# Altium schematic sheet LedMatrix_NanoBoardSingleDigit.SchDoc
size A4; Organization: Altium Limited; Address1: L3, 12a Rodborough Rd; Address2: Frenchs Forest; Address3: NSW; Address4: Australia 2086
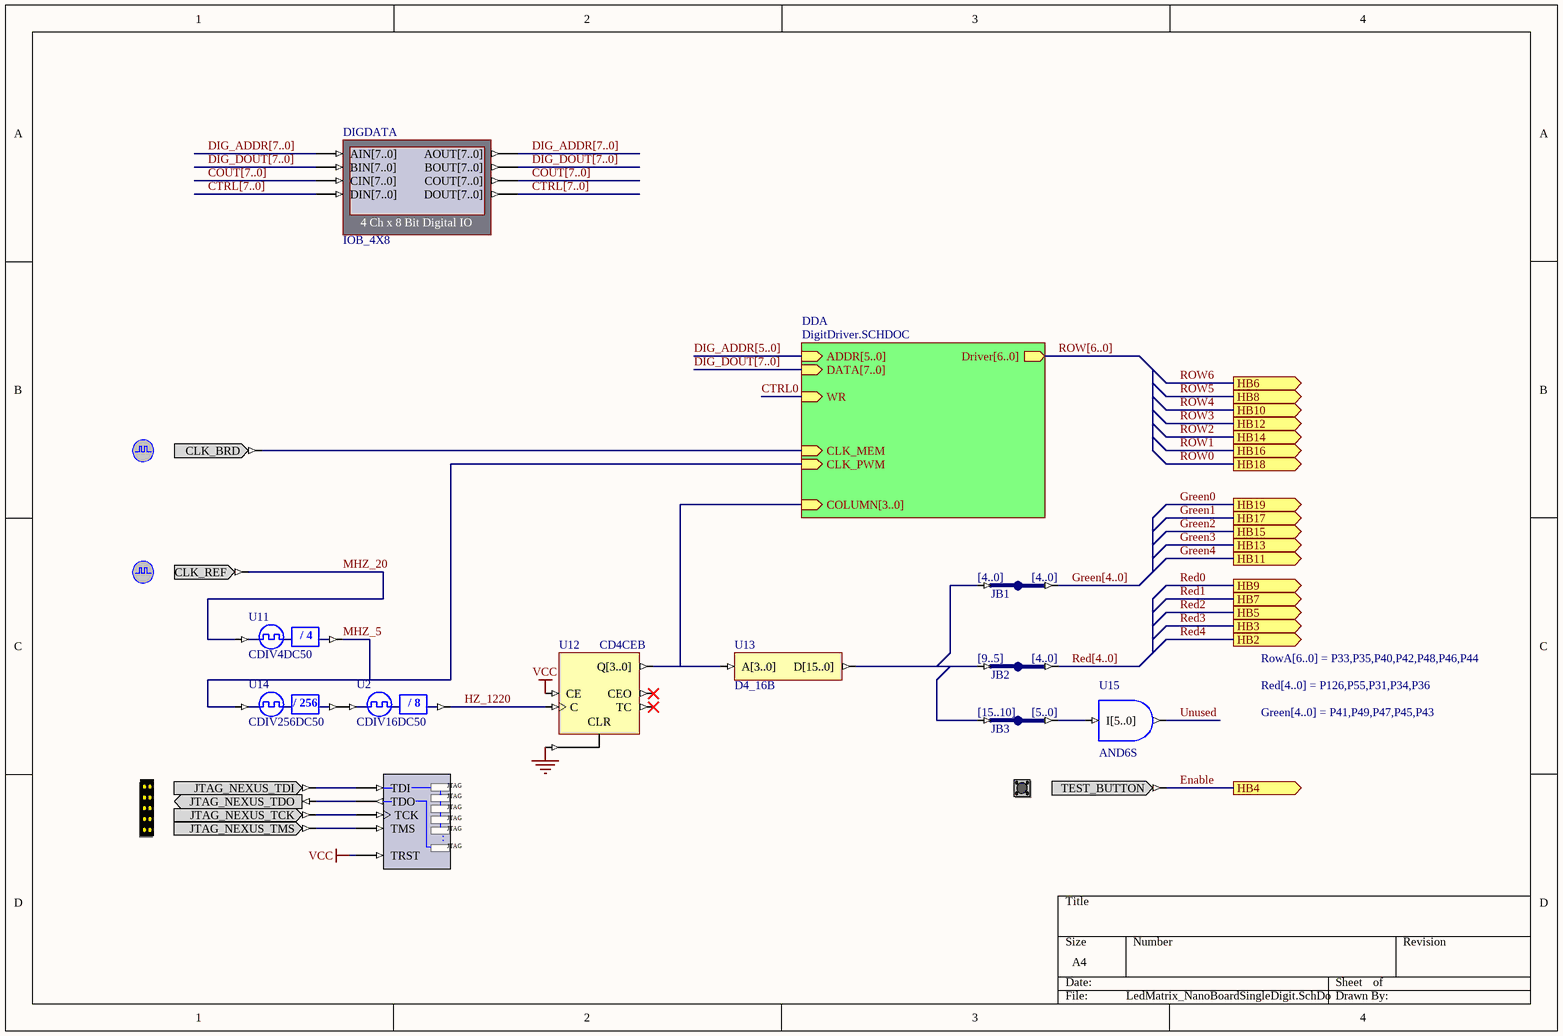
[diagram p0: LedMatrix_NanoBoardSingleDigit.SchDoc]

## Parts
(Parts that share a designator on the sheet are numbered #1, #2 ... from top to bottom, then left to right.)
?#1  CLOCK_BOARD  (value not drawn)
?#2  CLOCK_REFERENCE  (value not drawn)
?#3  NEXUS_JTAG_CONNECTOR  (value not drawn)
?#4  TEST_BUTTON  (value not drawn)
DIGDATA  IOB_4X8
JB1  IndexA: [4..0]  (hidden comment: JB)
JB2  IndexA: [9..5]  IndexB: [4..0]  (hidden comment: JB)
JB3  IndexA: [15..10]  IndexB: [5..0]  (hidden comment: JB)
NEXUS_JTAG_PORT  NEXUS_JTAG_PORT  (value not drawn)
U2  CDIV16DC50
U11  CDIV4DC50
U12  CD4CEB
U13  D4_16B
U14  CDIV256DC50
U15  AND6S

## Sub-sheets
DDA = DigitDriver.SCHDOC: COLUMN[3..0] (in), ADDR[5..0] (in), WR (in), DATA[7..0] (in), CLK_PWM (in), Driver[6..0] (out), CLK_MEM (in)

## Ports
HB2 (out), HB3 (out), HB4 (out), HB5 (out), HB6 (out), HB7 (out), HB8 (out), HB9 (out), HB10 (out), HB11 (out), HB12 (out), HB13 (out), HB14 (out), HB15 (out), HB16 (out), HB17 (out), HB18 (out), HB19 (out)

## Nets
GND: U12.CLR
VCC: NEXUS_JTAG_PORT.TRST U12.CE
COUT[7..0]: DIGDATA.CIN[7..0] DIGDATA.COUT[7..0]
CTRL0: sheet DDA/WR
CTRL[7..0]: DIGDATA.DIN[7..0] DIGDATA.DOUT[7..0]
DIG_ADDR[7..0]: DIGDATA.AIN[7..0] DIGDATA.AOUT[7..0]
DIG_DOUT[7..0]: DIGDATA.BIN[7..0] DIGDATA.BOUT[7..0] ; sheet DDA/DATA[7..0]
Enable: ?#4.TEST_BUTTON ; port HB4
Green0: port HB19
Green1: port HB17
Green2: port HB15
Green3: port HB13
Green4: port HB11
Green[4..0]: JB1.B[0..0]
HZ_1220: U2.CLKDV U12.C
MHZ_5: U11.CLKDV U14.CLKIN ; sheet DDA/CLK_PWM
MHZ_20: ?#2.CLK_REF U11.CLKIN
Red0: port HB9
Red1: port HB7
Red2: port HB5
Red3: port HB3
Red4: port HB2
Red[4..0]: JB2.B[0..0]
ROW0: port HB18
ROW1: port HB16
ROW2: port HB14
ROW3: port HB12
ROW4: port HB10
ROW5: port HB8
ROW6: port HB6
Unused: U15.O
Net?#1_CLK_BRD: ?#1.CLK_BRD ; sheet DDA/CLK_MEM
Net?#3_JTAG_NEXUS_TCK: ?#3.JTAG_NEXUS_TCK NEXUS_JTAG_PORT.TCK
Net?#3_JTAG_NEXUS_TDI: ?#3.JTAG_NEXUS_TDI NEXUS_JTAG_PORT.TDI
Net?#3_JTAG_NEXUS_TDO: ?#3.JTAG_NEXUS_TDO NEXUS_JTAG_PORT.TDO
Net?#3_JTAG_NEXUS_TMS: ?#3.JTAG_NEXUS_TMS NEXUS_JTAG_PORT.TMS
NetJB1_A[0..0]: JB1.A[0..0] JB2.A[0..0] JB3.A[0..0] U13.D[15..0]
NetJB3_B[0..0]: JB3.B[0..0] U15.I[5..0]
NetU2_CLKIN: U2.CLKIN U14.CLKDV
NetU12_Q[3..0]: U12.Q[3..0] U13.A[3..0] ; sheet DDA/COLUMN[3..0]

Not connected (* = marked no-connect by the designer): U12 CEO* TC*

## Buses and harness runs
bus COUT[7..0]
bus CTRL[7..0]
bus DIG_ADDR[5..0] = sheet DDA/ADDR[5..0]
bus DIG_ADDR[7..0]
bus DIG_DOUT[7..0]
bus DIG_DOUT[7..0] = sheet DDA/DATA[7..0]
bus Green[4..0]
bus Red[4..0]
bus ROW[6..0] = sheet DDA/Driver[6..0]

## Notes on the sheet
- Red[4..0] = P126,P55,P31,P34,P36
- Green[4..0] = P41,P49,P47,P45,P43
- RowA[6..0] = P33,P35,P40,P42,P48,P46,P44
- Title
- Size:
- Date:
- A4
- Number:
- Time:
- Revision:
- Sheet
- of
- File:
- (in symbol CDIV4DC50) / 4
- (in symbol CDIV8DC50) / 8
- (in symbol CDIV256DC50) / 256
- (in symbol NEXUS_JTAG_PORT) JTAG; .

## Library data of the parts
?#1 = CLOCK_BOARD: Global System Clock Supply; PortComponent: True; Published: 19-Nov-2003; Publisher: Altium Limited
?#2 = CLOCK_REFERENCE: Global System Clock Reference Supply; PortComponent: True; Published: 19-Nov-2003; Publisher: Altium Limited
?#3 = NEXUS_JTAG_CONNECTOR: JTAG Port; PortComponent: True; Published: 19-Nov-2003; Publisher: Altium Limited
?#4 = TEST_BUTTON: Test Button; PortComponent: True; Published: 19-Nov-2003; Publisher: Altium Limited
DIGDATA = IOB_4X8: 4 Ch x 8 Bit Digital IO; NEXUS_CORE: Instrument; NEXUS_JTAG_DEVICE: True; NEXUS_JTAG_ORDER: 0; Published: 30/09/2003; Publisher: Altium Hobart Technology Centre; Core Revision: 1.00.00
JB1-JB3 = JB: System Joiner; ArchiveName: GENERIC; Publisher: Altium Limited; Core Revision: 1.00.00
  JB1: IndexB: [4..0]
NEXUS_JTAG_PORT = NEXUS_JTAG_PORT: Soft Nexus-Chain Connector; NEXUS_JTAG_CONNECTOR: True; Published: 18-Dec-2003; Publisher: Altium Limited
U2 = CDIV8DC50: Clock Divider by 8 with 50% Duty Cycle Output; ArchiveName: GENERIC; Xilinx Equivalent: CLK_DIV8; Published: 18-Dec-2003; Publisher: Altium Limited; Core Revision: 1.00.00
U11 = CDIV4DC50: Clock Divider by 4 with 50% Duty Cycle Output; ArchiveName: GENERIC; Xilinx Equivalent: CLK_DIV4; Published: 18-Dec-2003; Publisher: Altium Limited; Core Revision: 1.00.00
U12 = CD4CEB: 4-Bit Cascadable BCD Counter with Clock Enable and Asynchronous Clear, Bus Version; ArchiveName: GENERIC; Published: 7-Nov-2003; Publisher: Altium Limited; Core Revision: 1.00.00
U13 = D4_16B: Binary 4- to 16-Bit Decoder, Bus Version; ArchiveName: GENERIC; Published: 7-Nov-2003; Publisher: Altium Limited; Core Revision: 1.00.00
U14 = CDIV256DC50: Clock Divider by 256 with 50% Duty Cycle Output; ArchiveName: GENERIC; Published: 18-Dec-2003; Publisher: Altium Limited; Core Revision: 1.00.00
U15 = AND6B: 6-Input AND Gate, Bus Version; ArchiveName: GENERIC; Publisher: Altium Limited; Core Revision: 1.00.00